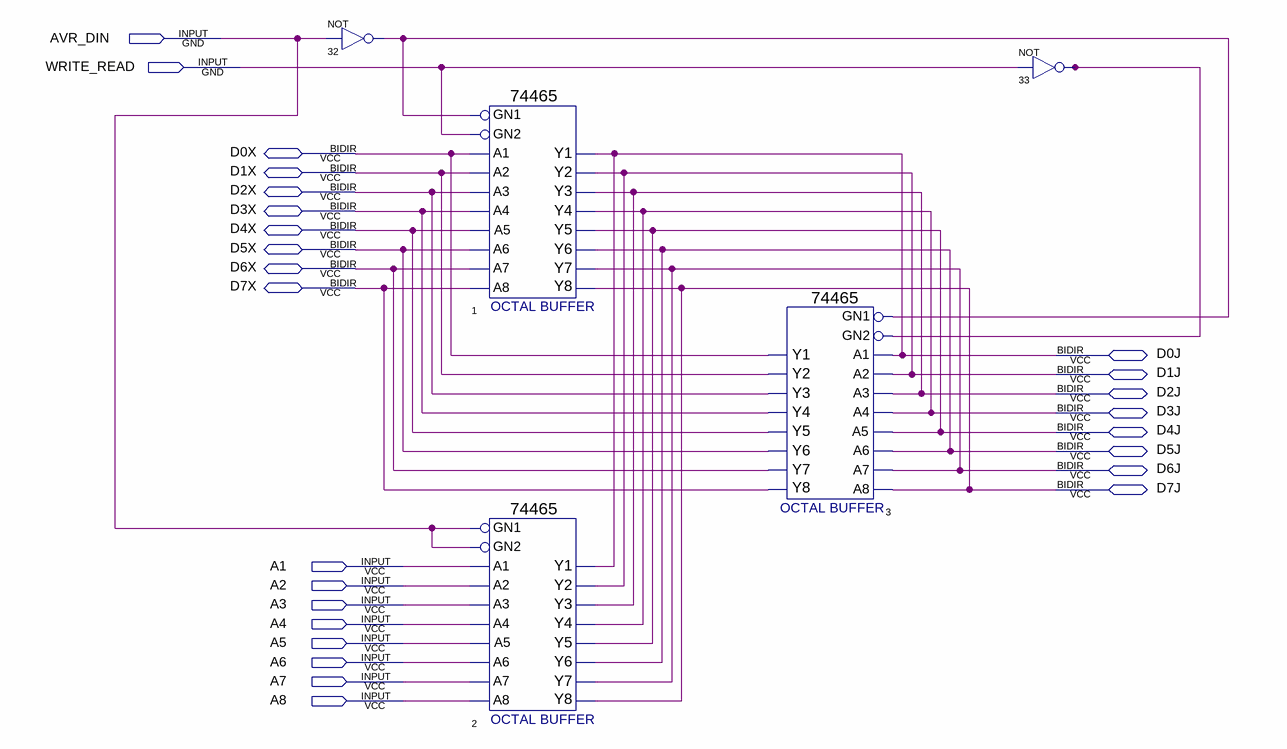
[diagram p0: schematic sheet]
// Quartus schematic mx8.bdf as structural Verilog: 5 symbols, 26 pins
module mx8 (
  input  AVR_DIN,
  input  WRITE_READ,
  input  A1,
  input  A2,
  input  A3,
  input  A4,
  input  A5,
  input  A6,
  input  A7,
  input  A8,
  inout  D0X,
  inout  D1X,
  inout  D2X,
  inout  D3X,
  inout  D4X,
  inout  D5X,
  inout  D6X,
  inout  D7X,
  inout  D0J,
  inout  D1J,
  inout  D2J,
  inout  D3J,
  inout  D4J,
  inout  D5J,
  inout  D6J,
  inout  D7J
);

  wire n32_out, n33_out;

  not u_32 (n32_out, AVR_DIN);
  \74465  u_1 (
    .GN1(n32_out), .GN2(WRITE_READ), .A1(D0X), .A2(D1X), .A3(D2X), .A4(D3X), .A6(D5X), .A7(D6X), .A8(D7X),
    .A5(D4X), .Y1(D0J), .Y3(D2J), .Y4(D3J), .Y5(D4J), .Y2(D1J), .Y7(D6J), .Y6(D5J), .Y8(D7J));
  \74465  u_2 (
    .GN1(AVR_DIN), .GN2(AVR_DIN), .A1(A1), .A2(A2), .A3(A3), .A4(A4), .A6(A6), .A7(A7), .A8(A8), .A5(A5),
    .Y1(D0J), .Y3(D2J), .Y4(D3J), .Y5(D4J), .Y2(D1J), .Y7(D6J), .Y6(D5J), .Y8(D7J));
  \74465  u_3 (
    .GN1(n32_out), .GN2(n33_out), .A1(D0J), .A2(D1J), .A3(D2J), .A4(D3J), .A6(D5J), .A7(D6J), .A8(D7J),
    .A5(D4J), .Y1(D0X), .Y3(D2X), .Y4(D3X), .Y5(D4X), .Y2(D1X), .Y7(D6X), .Y6(D5X), .Y8(D7X));
  not u_33 (n33_out, WRITE_READ);
endmodule
